# EAGLE design mercedes_shield_v1_recovered (EAGLE 5.11)
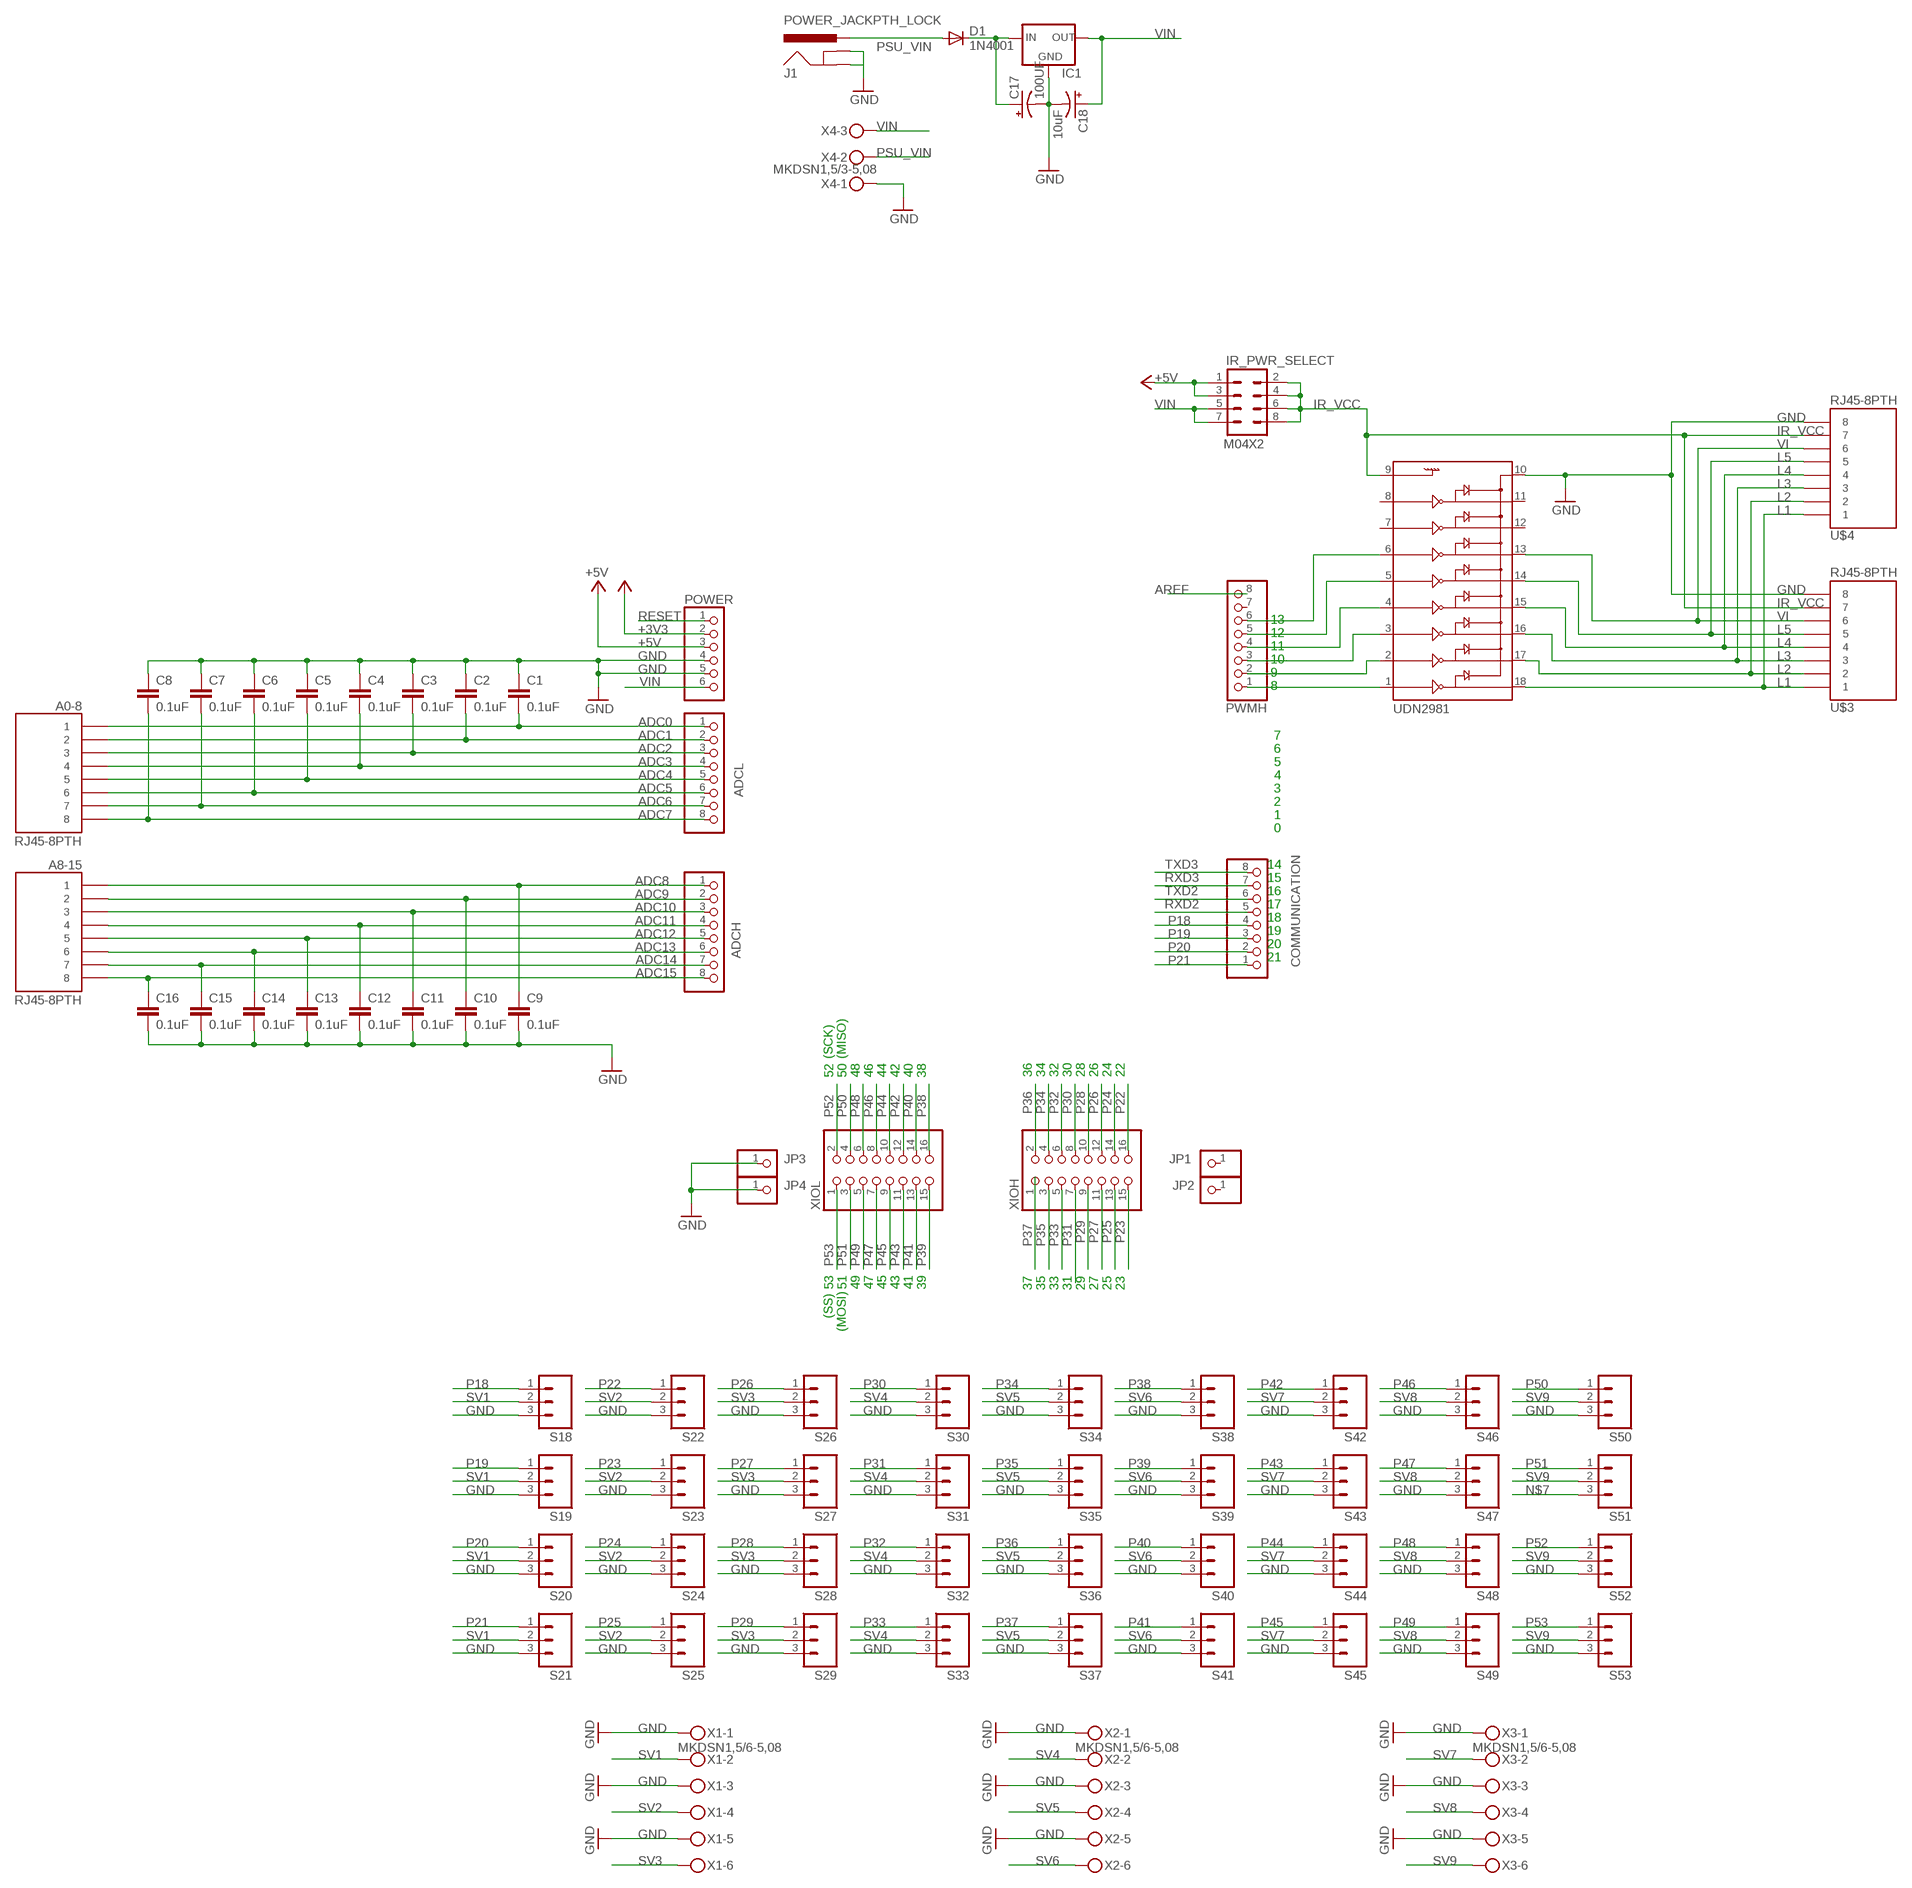
[diagram p0: schematic, sheet 1]

## Parts
A0-8  RJ45-8PTH  [RJ45-8]
A8-15  RJ45-8PTH  [RJ45-8]
ADCH  PINHD-1X8  [1X08]
ADCL  PINHD-1X8  [1X08]
C1  0.1uF  CAPPTH  [CAP-PTH-SMALL]
C2  0.1uF  CAPPTH  [CAP-PTH-SMALL]
C3  0.1uF  CAPPTH  [CAP-PTH-SMALL]
C4  0.1uF  CAPPTH  [CAP-PTH-SMALL]
C5  0.1uF  CAPPTH  [CAP-PTH-SMALL]
C6  0.1uF  CAPPTH  [CAP-PTH-SMALL]
C7  0.1uF  CAPPTH  [CAP-PTH-SMALL]
C8  0.1uF  CAPPTH  [CAP-PTH-SMALL]
C9  0.1uF  CAPPTH  [CAP-PTH-SMALL]
C10  0.1uF  CAPPTH  [CAP-PTH-SMALL]
C11  0.1uF  CAPPTH  [CAP-PTH-SMALL]
C12  0.1uF  CAPPTH  [CAP-PTH-SMALL]
C13  0.1uF  CAPPTH  [CAP-PTH-SMALL]
C14  0.1uF  CAPPTH  [CAP-PTH-SMALL]
C15  0.1uF  CAPPTH  [CAP-PTH-SMALL]
C16  0.1uF  CAPPTH  [CAP-PTH-SMALL]
C17  100UF  CAP_POLPTH1  [CPOL-RADIAL-100UF-25V]
C18  10uF  CAP_POLPTH2  [CPOL-RADIAL-10UF-25V]
COMMUNICATION  PINHD-1X8  [1X08]
D1  1N4001  DIODESMA  [SMA-DIODE]
IC1  V_REG_78XX-TO-220  [TO-220-ALT]
IR_PWR_SELECT  M04X2  [2X4]
J1  POWER_JACKPTH_LOCK  [POWER_JACK_PTH_LOCK]
JP1  PINHD-1X1  [1X01]
JP2  PINHD-1X1  [1X01]
JP3  PINHD-1X1  [1X01]
JP4  PINHD-1X1  [1X01]
POWER  PINHD-1X6  [1X06]
PWMH  PINHD-1X8  [1X08]
S18  M03PTH  [1X03]
S19  M03PTH  [1X03]
S20  M03PTH  [1X03]
S21  M03PTH  [1X03]
S22  M03PTH  [1X03]
S23  M03PTH  [1X03]
S24  M03PTH  [1X03]
S25  M03PTH  [1X03]
S26  M03PTH  [1X03]
S27  M03PTH  [1X03]
S28  M03PTH  [1X03]
S29  M03PTH  [1X03]
S30  M03PTH  [1X03]
S31  M03PTH  [1X03]
S32  M03PTH  [1X03]
S33  M03PTH  [1X03]
S34  M03PTH  [1X03]
S35  M03PTH  [1X03]
S36  M03PTH  [1X03]
S37  M03PTH  [1X03]
S38  M03PTH  [1X03]
S39  M03PTH  [1X03]
S40  M03PTH  [1X03]
S41  M03PTH  [1X03]
S42  M03PTH  [1X03]
S43  M03PTH  [1X03]
S44  M03PTH  [1X03]
S45  M03PTH  [1X03]
S46  M03PTH  [1X03]
S47  M03PTH  [1X03]
S48  M03PTH  [1X03]
S49  M03PTH  [1X03]
S50  M03PTH  [1X03]
S51  M03PTH  [1X03]
S52  M03PTH  [1X03]
S53  M03PTH  [1X03]
U$3  RJ45-8PTH  [RJ45-8]
U$4  RJ45-8PTH  [RJ45-8]
UDN2981  ULN2803DIP  [DIL18]
X1  MKDSN1,5/6-5,08  [MKDSN1,5/6-5,08]
X2  MKDSN1,5/6-5,08  [MKDSN1,5/6-5,08]
X3  MKDSN1,5/6-5,08  [MKDSN1,5/6-5,08]
X4  MKDSN1,5/3-5,08  [MKDSN1,5/3-5,08]
XIOH  PINHD-2X8  [2X08]
XIOL  PINHD-2X8  [2X08]

## Nets
+3V3: POWER.2
+5V: IR_PWR_SELECT.1 IR_PWR_SELECT.3 POWER.3
ADC0: A0-8.1 ADCL.1 C1.2
ADC1: A0-8.2 ADCL.2 C2.2
ADC2: A0-8.3 ADCL.3 C3.2
ADC3: A0-8.4 ADCL.4 C4.2
ADC4: A0-8.5 ADCL.5 C5.2
ADC5: A0-8.6 ADCL.6 C6.2
ADC6: A0-8.7 ADCL.7 C7.2
ADC7: A0-8.8 ADCL.8 C8.2
ADC8: A8-15.1 ADCH.1 C9.1
ADC9: A8-15.2 ADCH.2 C10.1
ADC10: A8-15.3 ADCH.3 C11.1
ADC11: A8-15.4 ADCH.4 C12.1
ADC12: A8-15.5 ADCH.5 C13.1
ADC13: A8-15.6 ADCH.6 C14.1
ADC14: A8-15.7 ADCH.7 C15.1
ADC15: A8-15.8 ADCH.8 C16.1
AREF: PWMH.8
GND: C1.1 C2.1 C3.1 C4.1 C5.1 C6.1 C7.1 C8.1 C9.2 C10.2 C11.2 C12.2 C13.2 C14.2 C15.2 C16.2 C17.2(-) C18.2(-) IC1.GND J1.GND J1.GNDBREAK JP3.1 JP4.1 POWER.4 POWER.5 S18.3 S19.3 S20.3 S21.3 S22.3 S23.3 S24.3 S25.3 S26.3 S27.3 S28.3 S29.3 S30.3 S31.3 S32.3 S33.3 S34.3 S35.3 S36.3 S37.3 S38.3 S39.3 S40.3 S41.3 S42.3 S43.3 S44.3 S45.3 S46.3 S47.3 S48.3 S49.3 S50.3 S52.3 S53.3 U$3.8 U$4.8 UDN2981.10 X1.1 X1.3 X1.5 X2.1 X2.3 X2.5 X3.1 X3.3 X3.5 X4.1
IR_VCC: IR_PWR_SELECT.2 IR_PWR_SELECT.4 IR_PWR_SELECT.6 IR_PWR_SELECT.8 U$3.7 U$4.7 UDN2981.9
L1: U$3.1 U$4.1 UDN2981.18
L2: U$3.2 U$4.2 UDN2981.17
L3: U$3.3 U$4.3 UDN2981.16
L4: U$3.4 U$4.4 UDN2981.15
L5: U$3.5 U$4.5 UDN2981.14
N$1: PWMH.1 UDN2981.1
N$2: PWMH.2 UDN2981.2
N$3: PWMH.3 UDN2981.3
N$4: PWMH.4 UDN2981.4
N$5: PWMH.5 UDN2981.5
N$6: PWMH.6 UDN2981.6
N$7: S51.3
N$10: C17.1(+) D1.C IC1.IN
P18: COMMUNICATION.4 S18.1
P19: COMMUNICATION.3 S19.1
P20: COMMUNICATION.2 S20.1
P21: COMMUNICATION.1 S21.1
P22: S22.1 XIOH.16
P23: S23.1 XIOH.15
P24: S24.1 XIOH.14
P25: S25.1 XIOH.13
P26: S26.1 XIOH.12
P27: S27.1 XIOH.11
P28: S28.1 XIOH.10
P29: S29.1 XIOH.9
P30: S30.1 XIOH.8
P31: S31.1 XIOH.7
P32: S32.1 XIOH.6
P33: S33.1 XIOH.5
P34: S34.1 XIOH.4
P35: S35.1 XIOH.3
P36: S36.1 XIOH.2
P37: S37.1 XIOH.1
P38: S38.1 XIOL.16
P39: S39.1 XIOL.15
P40: S40.1 XIOL.14
P41: S41.1 XIOL.13
P42: S42.1 XIOL.12
P43: S43.1 XIOL.11
P44: S44.1 XIOL.10
P45: S45.1 XIOL.9
P46: S46.1 XIOL.8
P47: S47.1 XIOL.7
P48: S48.1 XIOL.6
P49: S49.1 XIOL.5
P50: S50.1 XIOL.4
P51: S51.1 XIOL.3
P52: S52.1 XIOL.2
P53: S53.1 XIOL.1
PSU_VIN: D1.A J1.PWR X4.2
RESET: POWER.1
RXD2: COMMUNICATION.5
RXD3: COMMUNICATION.7
SV1: S18.2 S19.2 S20.2 S21.2 X1.2
SV2: S22.2 S23.2 S24.2 S25.2 X1.4
SV3: S26.2 S27.2 S28.2 S29.2 X1.6
SV4: S30.2 S31.2 S32.2 S33.2 X2.2
SV5: S34.2 S35.2 S36.2 S37.2 X2.4
SV6: S38.2 S39.2 S40.2 S41.2 X2.6
SV7: S42.2 S43.2 S44.2 S45.2 X3.2
SV8: S46.2 S47.2 S48.2 S49.2 X3.4
SV9: S50.2 S51.2 S52.2 S53.2 X3.6
TXD2: COMMUNICATION.6
TXD3: COMMUNICATION.8
VI: U$3.6 U$4.6 UDN2981.13
VIN: C18.1(+) IC1.OUT IR_PWR_SELECT.5 IR_PWR_SELECT.7 POWER.6 X4.3
Unconnected: JP1.1 JP2.1 PWMH.7 UDN2981.7 UDN2981.8 UDN2981.11 UDN2981.12

## Notes on the sheet
- 13
- 12
- 11
- 10
- 9
- 8
- 7
- 6
- 5
- 4
- 3
- 2
- 1
- 0
- 14
- 15
- 16
- 17
- 18
- 19
- 20
- 21
- (SCK) | (MISO)
- 52 | 50 | 48 | 46 | 44 | 42 | 40 | 38 | 36 | 34 | 32 | 30 | 28 | 26 | 24 | 22
- 53 | 51 | 49 | 47 | 45 | 43 | 41 | 39 | 37 | 35 | 33 | 31 | 29 | 27 | 25 | 23
- (SS)
- (MOSI)

## Library data of the parts
A0-8 A8-15 U$3 U$4 = SparkFun:RJ45-8: RJ45 Jack Simple RJ45, 8-pin connection - connector for common Cat5, Cat5e, and Cat6 Ethernet cables. Footprint not yet proven in production. Connector sku is PRT-00643; Breakout PCB sku is BOB-00716.
ADCH ADCL COMMUNICATION PWMH = pinhead:PINHD-1X8: PIN HEADER
C1-C16 = SparkFun:CAP: Capacitor Standard 0603 ceramic capacitor, and 0.1" leaded capacitor.
C17 C18 = SparkFun:CAP_POL: Capacitor Polarized These are standard SMD and PTH capacitors. Normally 10uF, 47uF, and 100uF in electrolytic and tantalum varieties. Always verify the external diameter of the through hole cap, it varies with capacity, voltage, and manufacturer. The EIA devices should be standard.
D1 = SparkFun:DIODE: Diode These are standard reverse protection diodes and small signal diodes. SMA package can handle up to about 1A. SOD-323 can handle about 200mA. What the SOD-323 package when ordering, there are some mfgs out there that are 5-pin packages.
IC1 = SparkFun:V_REG_78XX: Voltage Regulator Standard 7805 5V regulator. IGO (Input Ground Output). Spark Fun Electronics SKU : COM-00107
IR_PWR_SELECT = SparkFun:M04X2
J1 = SparkFun:POWER_JACK: Power Jack This is the standard 5.5mm barrel jack for power. The PTH is the most common, proven, reliable, footprint. All others are experimental. The Slot footprint only works if the mill layer is transmitted to the PCB fab house so be warned. Spark Fun Electronics SKU : PRT-00119. Mating wall wart : TOL-00298 (and others)
JP1-JP4 = pinhead:PINHD-1X1: PIN HEADER
POWER = pinhead:PINHD-1X6: PIN HEADER
S18-S53 = SparkFun:M03: Header 3 Standard 3-pin 0.1" header. Use with straight break away headers (SKU : PRT-00116), right angle break away headers (PRT-00553), swiss pins (PRT-00743), machine pins (PRT-00117), and female headers (PRT-00115). Molex polarized connector foot print use with SKU : PRT-08232 with associated crimp pins and housings.
UDN2981 = SparkFun:ULN2803: Darlington Driver ULN2803 Darlington array. 500mA max per channel, 8-channel package. Spark Fun Electronics SKU : COM-00312
X1-X3 = con-phoenix-508:MKDSN1,5/6-5,08: MKDSN 1,5/ 6-5,08 Printklemme Nennstrom: 13,5 A Nennspannung: 250 V Rastermaß: 5,08 mm Polzahl: 6 Anschlussart: Schraubanschluss Montage: Löten Anschlussrichtung Leiter/Platine: 0 ° Artikelnummer: 1729160 Source: http://eshop.phoenixcontact.com .. 1729160.pdf; MPN: SMKDSN1,5/6-5,08; OC_FARNELL: 1792907; OC_NEWARK: 70R0302
X4 = con-phoenix-508:MKDSN1,5/3-5,08: MKDSN 1,5/ 3-5,08 Printklemme Nennstrom: 13,5 A Nennspannung: 250 V Rastermaß: 5,08 mm Polzahl: 3 Anschlussart: Schraubanschluss Montage: Löten Anschlussrichtung Leiter/Platine: 0 ° Artikelnummer: 1729131 Source: http://eshop.phoenixcontact.com .. 1729131.pdf; MPN: SMKDSN1,5/3-5,08; OC_FARNELL: 1792904; OC_NEWARK: 70R0299
XIOH XIOL = pinhead:PINHD-2X8: PIN HEADER

## Net classes
0 default: width 0.152 mm, drill 0.305 mm, clearance 0.152 mm

## Board
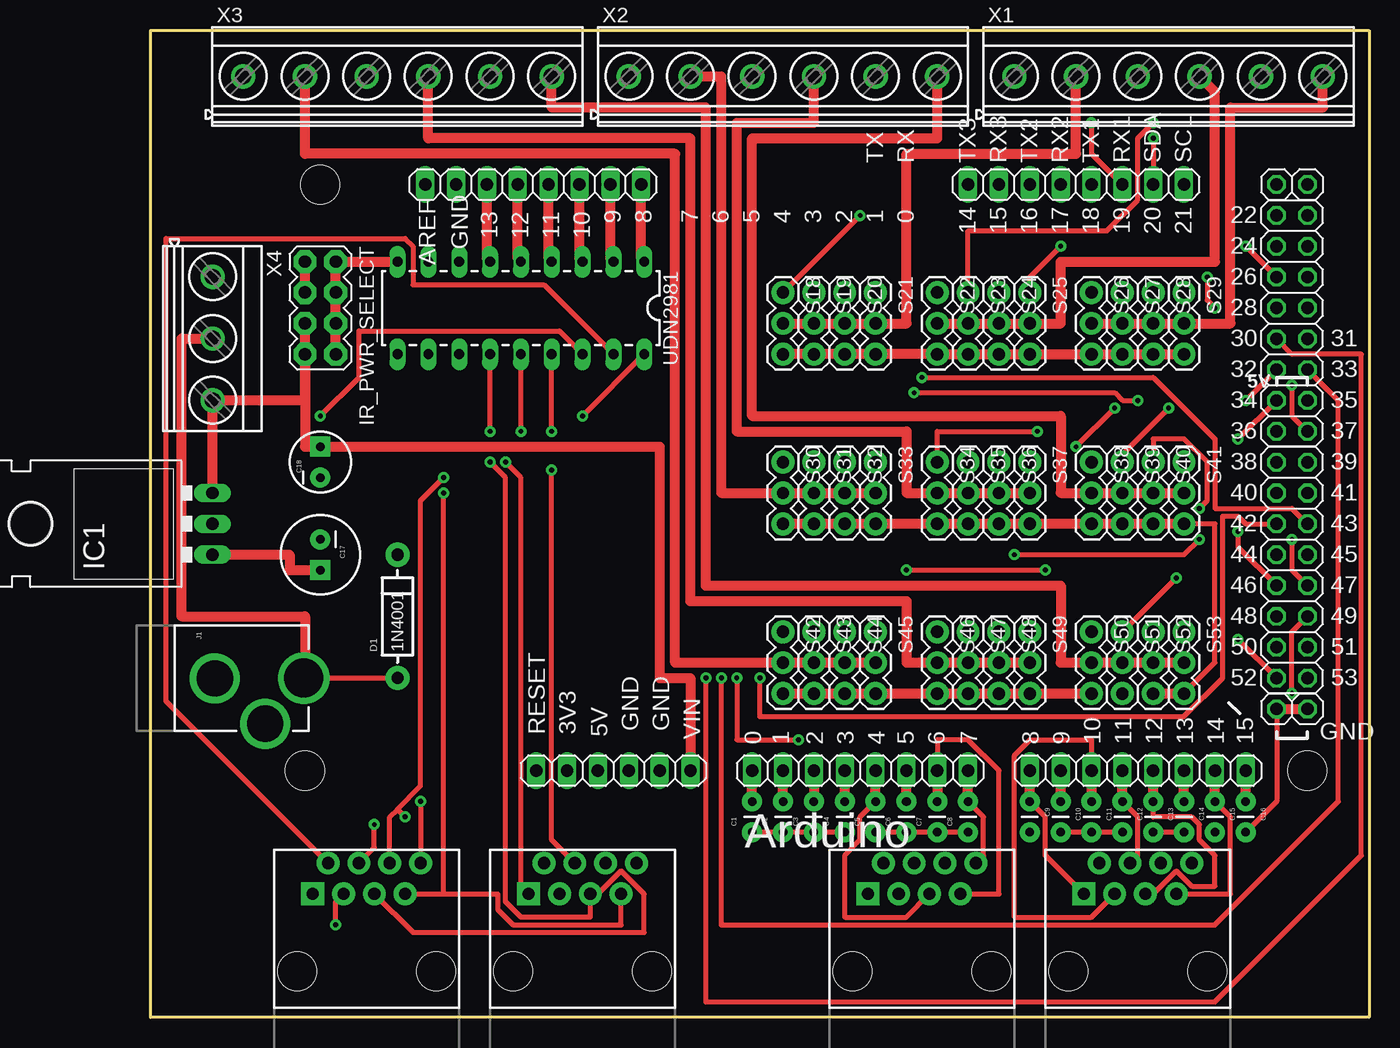
[diagram p1: board, top side]
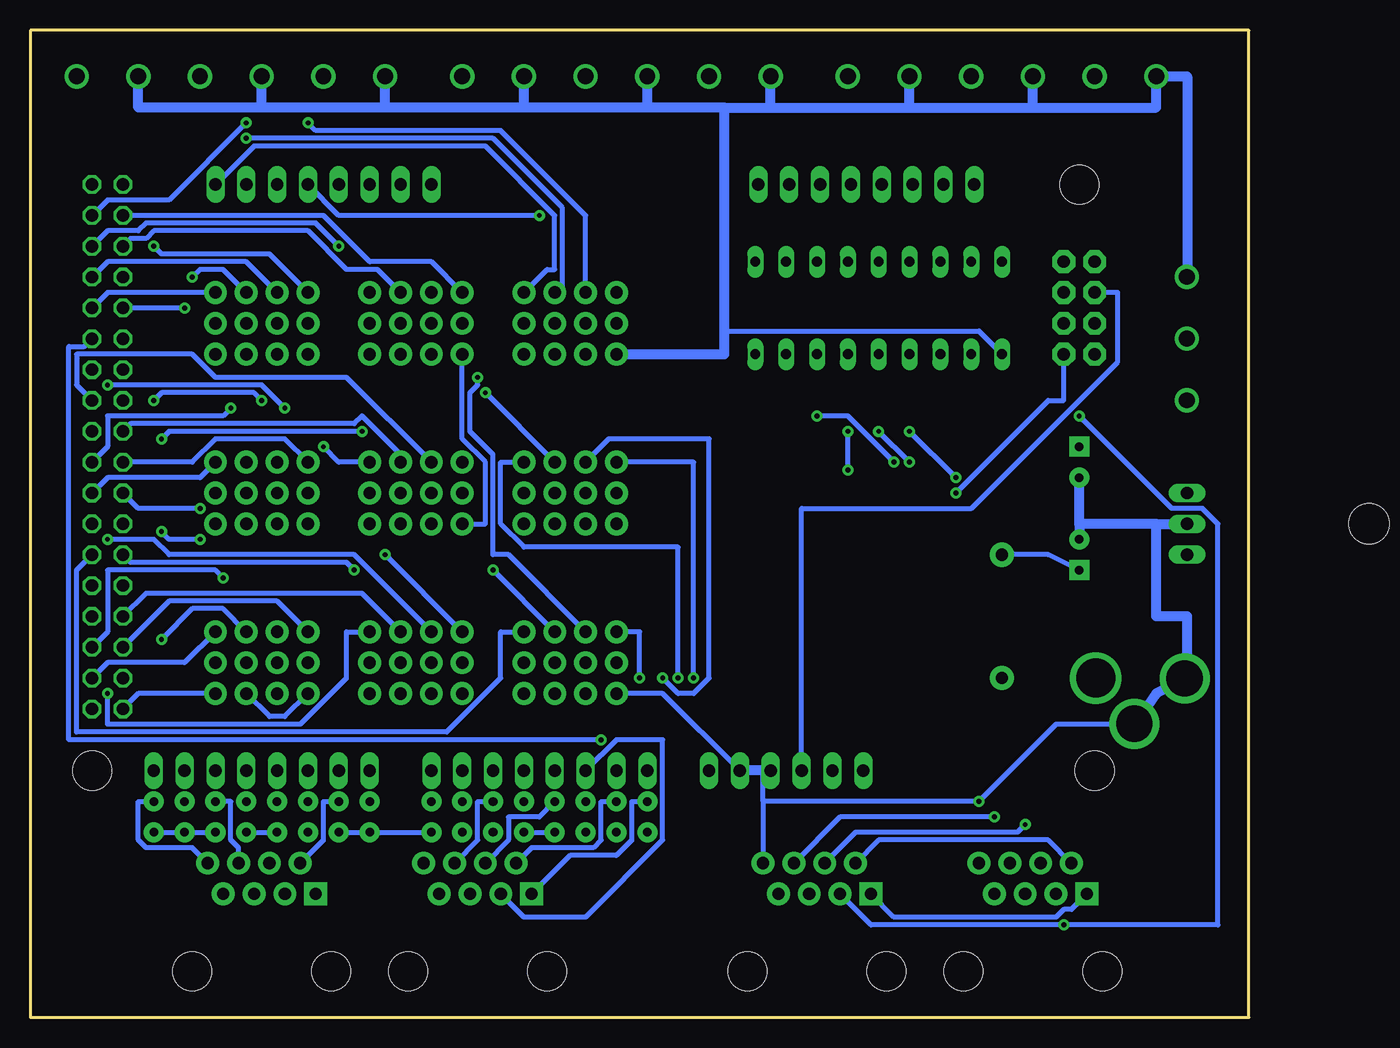
[diagram p2: board, bottom side, seen from below]

Size 100.33 x 81.28 mm. Coordinates in mm from the lower left corner, seen from the top.
Outline: 0,81.28 100.33,81.28 100.33,0 0,0 0,81.28
Copper layers (1*16): Top 0.035mm / dielectric 1.5mm / Bottom 0.035mm
Design rules "pcbtrain *": minimum track width 0.4mm, minimum drill 0.4mm, track to track 0.2mm, track to pad 0.2mm, pad to pad 0.2mm, via to via 0.2mm, smd to smd 0mil, copper to edge 10mil, drill to drill 0.2mm, minimum pad ring 10mil, minimum via ring 10mil, stop-mask expansion 0.125mm, vias tented up to drill 0mil, thermal gap 10mil
Holes 3.2 mm at 95.25,20.32 13.97,68.58 12.7,20.32

### Footprints (pad centres in the part's own frame; a part is rotated, then mirrored left to right if it is on the bottom)
RJ45-8 = drill 1 pad 1.88 square: 1 -4.445,6.35 | drill 1 pad 1.88 round: 2 -3.175,8.89; 3 -1.905,6.35; 4 -0.635,8.89; 5 0.635,6.35; 6 1.905,8.89; 7 3.175,6.35; 8 4.445,8.89 | hole 3.2: -5.715,0; 5.715,0
1X08 = drill 1.016 long: 1 -8.89,0; 2 -6.35,0; 3 -3.81,0; 4 -1.27,0; 5 1.27,0; 6 3.81,0; 7 6.35,0; 8 8.89,0
CAP-PTH-SMALL = drill 0.7 pad 1.651 round: 1 0,0; 2 2.54,0
CPOL-RADIAL-100UF-25V = drill 0.7 pad 1.651 square: 1 1.27,0 | drill 0.7 pad 1.651 round: 2 -1.27,0
CPOL-RADIAL-10UF-25V = drill 0.7 pad 1.651 square: 1 1.27,0 | drill 0.7 pad 1.651 round: 2 -1.27,0
DIODE-1N4001 = drill 1 pad 1.981 round: A -5.08,0; C 5.08,0
TO-220-ALT = drill 1.016 long: GND 0,-3.81; IN -2.54,-3.81; OUT 2.54,-3.81 | hole 3.302: 0,11.176
2X4 = drill 1.016 pad 1.88 octagon: 1 -3.81,-1.27; 2 -3.81,1.27; 3 -1.27,-1.27; 4 -1.27,1.27; 5 1.27,-1.27; 6 1.27,1.27; 7 3.81,-1.27; 8 3.81,1.27
POWER_JACK_PTH_LOCK = drill 2.997 pad 4.115 round: GND 0.025,6.557; GNDBREAK 3.762,10.7 | drill 3.2 pad 4.115 round: PWR 0,13.878
1X01 = drill 1.016 octagon: 1 0,0
1X06 = drill 1.016 long: 1 -6.35,0; 2 -3.81,0; 3 -1.27,0; 4 1.27,0; 5 3.81,0; 6 6.35,0
1X03 = drill 1.016 pad 1.88 round: 1 0,0; 2 2.54,0; 3 5.08,0
DIL18 = drill 0.813 long: 1 -10.16,-3.81; 2 -7.62,-3.81; 3 -5.08,-3.81; 4 -2.54,-3.81; 5 0,-3.81; 6 2.54,-3.81; 7 5.08,-3.81; 8 7.62,-3.81; 9 10.16,-3.81; 10 10.16,3.81; 11 7.62,3.81; 12 5.08,3.81; 13 2.54,3.81; 14 0,3.81; 15 -2.54,3.81; 16 -5.08,3.81; 17 -7.62,3.81; 18 -10.16,3.81
MKDSN1,5/6-5,08 = drill 1.3 pad 2 round: 1 -12.7,0.025; 2 -7.62,0.025; 3 -2.54,0.025; 4 2.54,0.025; 5 7.62,0.025; 6 12.7,0.025
MKDSN1,5/3-5,08 = drill 1.3 pad 2 round: 1 -7.641,0.025; 2 -2.561,0.025; 3 2.519,0.025
2X08 = drill 1.016 octagon: 1 -8.89,-1.27; 2 -8.89,1.27; 3 -6.35,-1.27; 4 -6.35,1.27; 5 -3.81,-1.27; 6 -3.81,1.27; 7 -1.27,-1.27; 8 -1.27,1.27; 9 1.27,-1.27; 10 1.27,1.27; 11 3.81,-1.27; 12 3.81,1.27; 13 6.35,-1.27; 14 6.35,1.27; 15 8.89,-1.27; 16 8.89,1.27

### Placement (x,y rotation side)
A0-8  63.5,3.81 0 top
A8-15  81.28,3.81 0 top
ADCH  81.28,20.32 0 top
ADCL  58.42,20.32 0 top
C1  49.53,15.24 90 top
C2  52.07,15.24 90 top
C3  54.61,15.24 90 top
C4  57.15,15.24 90 top
C5  59.69,15.24 90 top
C6  62.23,15.24 90 top
C7  64.77,15.24 90 top
C8  67.31,15.24 90 top
C9  72.39,17.78 270 top
C10  74.93,17.78 270 top
C11  77.47,17.78 270 top
C12  80.01,17.78 270 top
C13  82.55,17.78 270 top
C14  85.09,17.78 270 top
C15  87.63,17.78 270 top
C16  90.17,17.78 270 top
C17  13.97,38.1 270 top
C18  13.97,45.72 90 top
COMMUNICATION  76.2,68.58 180 top
D1  1N4001  [DIODE-1N4001]  20.32,33.02 90 top
IC1  1.27,40.64 90 top
IR_PWR_SELECT  13.97,58.42 270 top
J1  -1.27,27.94 270 top
JP1  92.71,68.58 0 top
JP2  95.25,68.58 0 top
JP3  92.71,25.4 0 top
JP4  95.25,25.4 0 top
POWER  38.1,20.32 0 top
PWMH  31.5,68.58 180 top
S18  52.07,59.69 270 top
S19  54.61,59.69 270 top
S20  57.15,59.69 270 top
S21  59.69,59.69 270 top
S22  64.77,59.69 270 top
S23  67.31,59.69 270 top
S24  69.85,59.69 270 top
S25  72.39,59.69 270 top
S26  77.47,59.69 270 top
S27  80.01,59.69 270 top
S28  82.55,59.69 270 top
S29  85.09,59.69 270 top
S30  52.07,45.72 270 top
S31  54.61,45.72 270 top
S32  57.15,45.72 270 top
S33  59.69,45.72 270 top
S34  64.77,45.72 270 top
S35  67.31,45.72 270 top
S36  69.85,45.72 270 top
S37  72.39,45.72 270 top
S38  77.47,45.72 270 top
S39  80.01,45.72 270 top
S40  82.55,45.72 270 top
S41  85.09,45.72 270 top
S42  52.07,31.75 270 top
S43  54.61,31.75 270 top
S44  57.15,31.75 270 top
S45  59.69,31.75 270 top
S46  64.77,31.75 270 top
S47  67.31,31.75 270 top
S48  69.85,31.75 270 top
S49  72.39,31.75 270 top
S50  77.47,31.75 270 top
S51  80.01,31.75 270 top
S52  82.55,31.75 270 top
S53  85.09,31.75 270 top
U$3  35.56,3.81 0 top
U$4  17.78,3.81 0 top
UDN2981  30.48,58.42 180 top
X1  83.82,77.47 0 top
X2  52.07,77.47 0 top
X3  20.32,77.47 0 top
X4  5.08,53.34 270 top
XIOH  93.98,57.15 90 top
XIOL  93.98,36.83 90 top

### Tracks (layer width: path | path; a pad name or v marks a point on that pad's centre or on a via)
+5V
  Top 0.813: IR_PWR_SELECT.3 IR_PWR_SELECT.1
  Bottom 0.4: POWER.3 36.83,41.91 22.86,41.91 10.79,53.98 10.79,59.69 IR_PWR_SELECT.3
ADC0
  Top 0.813: C1.2 ADCL.1
  Bottom 0.4: A0-8.1 55.88,13.34 52.07,13.34 50.8,14.61 50.8,17.78 C1.2
ADC1
  Top 0.813: C2.2 ADCL.2
  Bottom 0.4: A0-8.2 59.05,13.97 53.97,13.97 53.34,14.61 53.34,17.78 C2.2
ADC2
  Top 0.813: ADCL.3 C3.2
  Bottom 0.4: A0-8.3 59.69,8.26 54.61,8.26 48.26,14.61 48.26,22.86 52.07,22.86 ADCL.3
ADC3
  Top 0.813: C4.2 ADCL.4
  Bottom 0.4: A0-8.4 60.96,14.61 60.96,16.51 58.42,16.51 C4.2
ADC4
  Top 0.4: A0-8.5 62.23,8.26 57.15,8.26 57.15,13.34 58.42,14.61 58.42,16.51 C5.2
  Top 0.813: C5.2 ADCL.5
ADC5
  Top 0.813: C6.2 ADCL.6
  Bottom 0.4: A0-8.6 63.5,14.61 63.5,17.78 C6.2
ADC6
  Top 0.4: A0-8.7 69.85,10.16 69.85,20.32 67.31,22.86 64.77,22.86 ADCL.7
  Top 0.813: ADCL.7 C7.2
ADC7
  Top 0.4: A0-8.8 68.58,13.34 68.58,16.51 C8.2
  Top 0.813: C8.2 ADCL.8
ADC8
  Top 0.4: A8-15.1 73.66,13.34 73.66,16.51 C9.1
  Top 0.813: C9.1 ADCH.1
ADC9
  Top 0.813: C10.1 ADCH.2
  Bottom 0.4: A8-15.2 76.2,14.61 76.2,17.78 C10.1
ADC10
  Top 0.4: A8-15.3 77.47,8.26 71.12,8.26 71.12,21.59 72.39,22.86 77.47,22.86 ADCH.3
  Top 0.813: ADCH.3 C11.1
ADC11
  Top 0.4: A8-15.4 81.28,13.34 81.28,16.51 C12.1
  Top 0.813: C12.1 ADCH.4
ADC12
  Top 0.4: A8-15.5 82.55,10.16 84.45,12.06 85.73,10.79 87.63,10.79 87.63,13.34 86.36,14.61 86.36,15.88 85.73,16.51 82.55,16.51 C13.1
  Top 0.813: C13.1 ADCH.5
ADC13
  Top 0.813: C14.1 ADCH.6
  Bottom 0.4: A8-15.6 83.19,13.97 83.82,14.61 83.82,17.78 C14.1
ADC14
  Top 0.4: A8-15.7 88.9,10.16 88.9,16.51 C15.1
  Top 0.813: C15.1 ADCH.7
ADC15
  Top 0.813: C16.1 ADCH.8
  Bottom 0.4: A8-15.8 87,13.97 90.81,13.97 91.44,14.61 91.44,17.78 C16.1
GND  (via drill 0.4)
  Top 0.4: C1.1 C2.1 C3.1 C4.1 | C5.1 C6.1 C7.1 C8.1 | C10.2 C11.2 C12.2 | C14.2 C13.2 | v22.23,17.78 U$4.8 | C16.2 92.71,17.78 JP3.1 | S41.3 87.63,40.64 87.63,29.21 S53.3
  Top 0.813: S18.3 S19.3 S20.3 S21.3 S22.3 S23.3 S24.3 S25.3 S26.3 S27.3 S28.3 S29.3 | S30.3 S31.3 S32.3 S33.3 S34.3 S35.3 S36.3 S37.3 S38.3 S39.3 S40.3 S41.3 | S52.3 S53.3 | S50.3 S49.3 S48.3 S47.3 S46.3 S45.3 S44.3 S43.3 S42.3 | JP3.1 JP4.1
  Bottom 0.4: UDN2981.10 22.23,56.52 43.18,56.52 | S22.3 64.77,47.62 62.87,45.72 62.87,40.64 S34.3 | C5.1 C4.1 | C10.2 C9.2 C8.1 | C14.2 C15.2 C16.2 | C13.2 C12.2 | J1.GNDBREAK 9.53,24.13 15.88,24.13 v22.23,17.78 40,17.78 | 40,17.78 40,20.32 | 40,17.78 U$3.8 | JP3.1 91.44,26.67 S53.3 | S52.3 80.65,24.77 79.38,24.77 S50.3 | POWER.5 48.26,26.67 S42.3
  Bottom 0.813: POWER.4 40,20.32 POWER.5 | 7.62,40.64 IC1.GND | 7.62,40.64 13.97,40.64 | 13.97,40.64 C17.2 | 13.97,40.64 C18.2 | 5.08,27.94 5.08,33.02 7.62,33.02 7.62,40.64 | J1.GND 5.11,27.91 5.08,27.94 | 5.08,27.94 7.62,26.67 9.38,24.13 J1.GNDBREAK | X4.1 5.08,61.01 5.08,77.47 5.11,77.5 X3.1 7.62,74.93 17.78,74.93 | 17.78,74.93 X3.3 | 27.94,74.93 17.78,74.93 | 27.94,74.93 X3.5 | 39.37,74.93 27.94,74.93 | 43.18,74.93 39.37,74.93 | 43.18,74.93 49.53,74.93 | 49.53,74.93 X2.3 | 49.53,74.93 59.69,74.93 | 59.69,74.93 X2.5 | 59.69,74.93 71.12,74.93 | 71.12,74.93 X1.1 | 71.12,74.93 81.28,74.93 | 81.28,74.93 X1.3 | 81.28,74.93 91.44,74.93 X1.5 | 39.37,74.93 X2.1 | S18.3 43.18,54.61 43.18,56.52 43.18,74.93
IR_VCC  (via drill 0.4)
  Top 0.4: 24.13,10.16 28.57,10.16 28.57,8.89 29.84,7.62 38.73,7.62 U$3.7 | U$4.7 24.13,10.16 | 24.13,10.16 v24.13,43.18
  Top 0.813: IR_PWR_SELECT.8 IR_PWR_SELECT.6 IR_PWR_SELECT.4 IR_PWR_SELECT.2 UDN2981.9
  Bottom 0.4: IR_PWR_SELECT.8 15.24,50.8 16.51,50.8 v24.13,43.18
L1  (via drill 0.4)
  Top 0.4: v35.56,49.53 UDN2981.18 | v29.21,45.72 30.48,44.45 30.48,10.79 U$3.1
  Bottom 0.4: v35.56,49.53 33.02,49.53 v29.21,45.72 | U$4.1 14.61,8.89 15.24,8.89 15.88,8.26 29.21,8.26 U$3.1
L2
  Top 0.4: UDN2981.17 32.38,60.33 21.59,60.33 21.59,63.5 20.96,64.14 1.27,64.14 1.27,26.04 U$4.2
  Bottom 0.4: U$3.2 30.48,14.61 16.51,14.61 U$4.2
L3  (via drill 0.4)
  Top 0.4: UDN2981.16 33.65,56.52 17.14,56.52 17.14,52.7 v13.97,49.53 | U$4.3 15.24,9.53 v15.24,7.62
  Bottom 0.4: v13.97,49.53 6.35,41.91 3.81,41.91 2.54,40.64 2.54,7.62 v15.24,7.62 31.11,7.62 U$3.3
L4  (via drill 0.4)
  Top 0.4: v33.02,48.26 UDN2981.15 | v33.02,45.09 33.02,14.61 U$3.4 | U$4.4 18.41,13.97 v18.41,15.88
  Bottom 0.4: v33.02,45.09 v33.02,48.26 | v18.41,15.88 19.05,15.24 32.38,15.24 U$3.4
L5  (via drill 0.4)
  Top 0.4: v30.48,48.26 UDN2981.14 | v27.94,45.72 29.21,44.45 29.21,9.53 30.48,8.26 36.2,8.26 36.2,9.53 | U$4.5 21.59,6.99 40.64,6.99 40.64,10.16 38.73,12.06 36.2,9.53 | 36.2,9.53 U$3.5
  Bottom 0.4: v27.94,45.72 v30.48,48.26
N$1
  Top 0.813: PWMH.1 40.39,62.48 UDN2981.1
N$2
  Top 0.813: PWMH.2 37.85,62.48 UDN2981.2
N$3
  Top 0.813: PWMH.3 35.31,62.48 UDN2981.3
N$4
  Top 0.813: PWMH.4 32.77,62.48 UDN2981.4
N$5
  Top 0.813: PWMH.5 30.23,62.48 UDN2981.5
N$6
  Top 0.813: PWMH.6 27.69,62.48 UDN2981.6
N$10
  Top 0.813: IC1.IN 11.43,38.1 11.43,36.83 C17.1
  Bottom 0.4: D1.C 16.51,38.1 C17.1
P18  (via drill 0.4)
  Top 0.4: S18.1 v58.42,66.04
  Bottom 0.4: COMMUNICATION.4 74.93,66.04 v58.42,66.04
P19  (via drill 0.4)
  Top 0.4: COMMUNICATION.3 77.47,71.12 v77.47,73.66
  Bottom 0.4: v77.47,73.66 76.84,73.03 61.59,73.03 54.61,66.04 S19.1
P20  (via drill 0.4)
  Top 0.4: v82.55,72.39 COMMUNICATION.2
  Bottom 0.4: v82.55,72.39 62.23,72.39 56.51,66.67 56.51,59.69 S20.1
P21
  Bottom 0.4: COMMUNICATION.1 81.92,71.75 62.87,71.75 57.15,66.04 57.15,61.59 57.78,61.59 S21.1
P22
  Bottom 0.4: XIOH.16 76.2,66.04 72.39,62.23 67.31,62.23 S22.1
P23  (via drill 0.4)
  Top 0.4: v82.55,73.66 81.28,72.39 81.28,67.31 78.74,64.77 67.31,64.77 S23.1
  Bottom 0.4: XIOH.15 93.98,67.31 88.9,67.31 v82.55,73.66
P24
  Bottom 0.4: XIOH.14 92.08,64.14 90.81,64.14 90.17,64.77 77.47,64.77 74.3,61.59 71.76,61.59 S24.1
P25  (via drill 0.4)
  Top 0.4: v74.93,63.5 72.39,60.96 S25.1
  Bottom 0.4: XIOH.13 93.98,64.77 91.44,64.77 90.81,65.41 76.84,65.41 v74.93,63.5
P26  (via drill 0.4)
  Top 0.4: v90.17,63.5 XIOH.12
  Bottom 0.4: v90.17,63.5 89.54,62.87 80.65,62.87 S26.1
P27
  Bottom 0.4: XIOH.11 93.98,62.23 82.55,62.23 S27.1
P28  (via drill 0.4)
  Top 0.4: v87.63,58.42 87,59.05 v87,60.96
  Bottom 0.4: v87.63,58.42 XIOH.10 | v87,60.96 86.36,61.59 84.45,61.59 S28.1
P29
  Bottom 0.4: XIOH.9 93.98,59.69 S29.1
P30  (via drill 0.4)
  Top 0.4: XIOH.8 93.98,54.61 99.7,54.61 99.7,13.34 87.63,1.27 45.72,1.27 v45.72,27.94
  Bottom 0.4: v45.72,27.94 45.72,45.72 S30.1
P31  (via drill 0.4)
  Top 0.4: v53.34,22.86 48.26,22.86 v48.26,27.94
  Bottom 0.4: XIOH.7 95.89,55.24 97.16,55.24 97.16,22.86 v53.34,22.86 | v48.26,27.94 46.99,26.67 45.72,26.67 44.45,27.94 44.45,47.62 52.7,47.62 S31.1
P32  (via drill 0.4)
  Top 0.4: v90.17,50.8 XIOH.6 | v81.28,50.8 80.01,50.8 79.38,51.44 v62.87,51.44
  Bottom 0.4: v90.17,50.8 89.54,51.44 81.92,51.44 v81.28,50.8 | S32.1 v62.87,51.44
P33  (via drill 0.4)
  Top 0.4: XIOH.5 97.79,50.8 97.79,17.78 87.63,7.62 46.99,7.62 v46.99,27.94
  Bottom 0.4: v46.99,27.94 46.99,38.73 59.69,38.73 61.59,40.64 61.59,45.72 S33.1
P34  (via drill 0.4)
  Top 0.4: v89.54,47.62 XIOH.4 | v73.03,48.26 64.77,48.26 S34.1
  Bottom 0.4: v89.54,47.62 88.9,48.26 v73.03,48.26
P35
  Bottom 0.4: XIOH.3 96.52,52.07 96.52,54.61 87,54.61 85.09,52.7 74.3,52.7 S35.1
P36
  Bottom 0.4: XIOH.2 92.08,48.9 73.66,48.9 73.03,49.53 69.85,46.35 S36.1
P37  (via drill 0.4)
  Top 0.4: XIOH.1 93.98,49.53 v93.98,52.07 | v76.2,46.99 v79.38,50.16
  Bottom 0.4: v93.98,52.07 81.28,52.07 v79.38,50.16 | v76.2,46.99 74.93,45.72 S37.1
P38
  Bottom 0.4: XIOL.16 87,45.72 85.09,47.62 79.38,47.62 S38.1
P39  (via drill 0.4)
  Top 0.4: v83.82,50.16 80.01,46.35 S39.1
  Bottom 0.4: XIOL.15 93.98,46.99 93.98,49.53 84.45,49.53 v83.82,50.16
P40  (via drill 0.4)
  Top 0.4: v86.36,41.91 87,42.55 87,45.72 85.09,47.62 82.55,47.62 S40.1
  Bottom 0.4: XIOL.14 91.44,41.91 v86.36,41.91
P41
  Bottom 0.4: XIOL.13 93.98,44.45 86.36,44.45 S41.1
P42  (via drill 0.4)
  Top 0.4: XIOL.12 90.17,40.64 89.54,41.27 88.27,41.27 88.27,27.94 85.09,24.77 50.16,24.77 v50.16,27.94
  Bottom 0.4: v50.16,27.94 50.16,31.75 S42.1
P43  (via drill 0.4)
  Top 0.4: XIOL.11 93.98,41.91 87.63,41.91 87.63,47.62 82.55,52.7 v63.5,52.7
  Bottom 0.4: v63.5,52.7 63.5,52.07 64.14,51.44 64.14,48.26 62.23,46.35 62.23,38.1 60.96,38.1 S43.1
P44  (via drill 0.4)
  Top 0.4: v62.23,36.83 v73.66,36.83
  Bottom 0.4: XIOL.10 92.08,37.47 74.3,37.47 v73.66,36.83 | S44.1 v62.23,36.83
P45
  Bottom 0.4: XIOL.9 96.52,36.83 96.52,23.5 66.04,23.5 61.59,27.94 61.59,31.75 S45.1
P46  (via drill 0.4)
  Top 0.4: XIOL.8 89.54,38.73 v89.54,40.01 | v86.36,39.37 85.09,38.1 v71.12,38.1
  Bottom 0.4: v89.54,40.01 88.9,39.37 v86.36,39.37 | S46.1 v71.12,38.1
P47  (via drill 0.4)
  Top 0.4: XIOL.7 93.98,36.83 v93.98,39.37
  Bottom 0.4: v93.98,39.37 90.17,39.37 88.9,38.1 73.66,38.1 S47.1
P48
  Bottom 0.4: XIOL.6 90.81,34.92 73.03,34.92 S48.1
P49  (via drill 0.4)
  Top 0.4: XIOL.5 93.98,31.75 v93.98,26.67
  Bottom 0.4: v93.98,26.67 93.98,24.13 78.11,24.13 74.3,27.94 74.3,31.75 S49.1
P50
  Bottom 0.4: XIOL.4 88.9,34.29 80.01,34.29 S50.1
P51  (via drill 0.4)
  Top 0.4: S51.1 v84.45,36.2
  Bottom 0.4: XIOL.3 93.98,31.75 93.98,36.83 85.09,36.83 v84.45,36.2
P52  (via drill 0.4)
  Top 0.4: v89.54,31.11 XIOL.2
  Bottom 0.4: v89.54,31.11 87,33.66 84.45,33.66 S52.1
P53
  Bottom 0.4: XIOL.1 93.98,29.21 87.63,29.21 S53.1
PSU_VIN
  Top 0.4: J1.PWR D1.A
  Top 0.813: X4.2 2.56,55.9 2.54,55.88 2.54,33.02 12.7,33.02 12.7,28.03 J1.PWR
SV1
  Top 0.813: S18.2 S19.2 S20.2 S21.2 62.23,57.15 62.23,71.12 76.2,71.12 X1.2
SV2
  Top 0.813: S22.2 S23.2 S24.2 S25.2 74.93,57.15 74.93,62.23 87.63,62.23 87.63,76.22 X1.4
SV3
  Top 0.813: S26.2 S27.2 S28.2 S29.2 88.9,57.15 88.9,74.93 96.52,74.93 X1.6
SV4
  Top 0.813: S33.2 S32.2 S31.2 S30.2 46.99,43.18 46.99,77.47 44.47,77.47 X2.2
SV5
  Top 0.813: X2.4 54.61,73.66 48.26,73.66 48.26,48.26 62.23,48.26 62.23,43.18 S34.2 S35.2 S36.2 S37.2
SV6
  Top 0.813: S41.2 S40.2 S39.2 S38.2 74.93,43.18 74.93,49.53 49.53,49.53 49.53,72.39 64.77,72.39 X2.6
SV7
  Top 0.813: X3.2 12.7,71.12 43.18,71.12 43.18,29.21 S42.2 S43.2 S44.2 S45.2
SV8
  Top 0.813: X3.4 22.86,72.39 44.45,72.39 44.45,34.29 62.23,34.29 62.23,29.21 S46.2 S47.2 S48.2 S49.2
SV9
  Top 0.813: X3.6 33.02,74.93 45.72,74.93 45.72,35.56 74.93,35.56 74.93,29.21 S50.2 S51.2 S52.2 S53.2
VI  (via drill 0.4)
  Top 0.4: v27.94,48.26 UDN2981.13 | v24.13,44.45 22.23,42.55 22.23,19.05 20.32,17.14 | 20.32,17.14 19.68,16.51 U$4.6 | 20.32,17.14 v20.96,16.51
  Bottom 0.4: v24.13,44.45 v27.94,48.26 | U$3.6 33.65,16.51 v20.96,16.51
VIN
  Top 0.813: IR_PWR_SELECT.7 IR_PWR_SELECT.5 | IC1.OUT 5.11,43.2 X4.3 12.68,50.82 12.7,50.8 IR_PWR_SELECT.7 | IR_PWR_SELECT.7 12.7,46.99 C18.1 41.91,46.99 41.91,27.94 44.45,27.94 POWER.6

### Text on the board
tPlace: 9 | 8 | 7 | 6 | 5 | 4 | 3 | 2 | 1 | 0 | 14 | 15 | 16 | 17 | 18 | 19 | 20 | 21 | 22 | 13 | 12 | 11 | 10 | 24 | 26 | 28 | 30 | 31 | 32 | 33 | 34 | 35 | 36 | 37 | 38 | 39 | 40 | 41 | 42 | 43 | 44 | 45 | 46 | 47 | 48 | 49 | 50 | 51 | 52 | 53 | 0 | 1 | 2 | 3 | 4 | 5 | 6 | 7 | 8 | 9 | 10 | 11 | 12 | 13 | 14 | 15
tNames: TX | RX | TX3 | RX3 | TX2 | RX2 | TX1 | RX1 | SDA | SCL | GND | AREF | 5V | GND | GND | RESET | 3V3 | 5V | VIN | GND | Arduino
ReferenceLC: L | TX | RX | PC1 | PC2